# EAGLE design Adafruit NeoRGB Stemma Rev B (EAGLE 9.6.2)
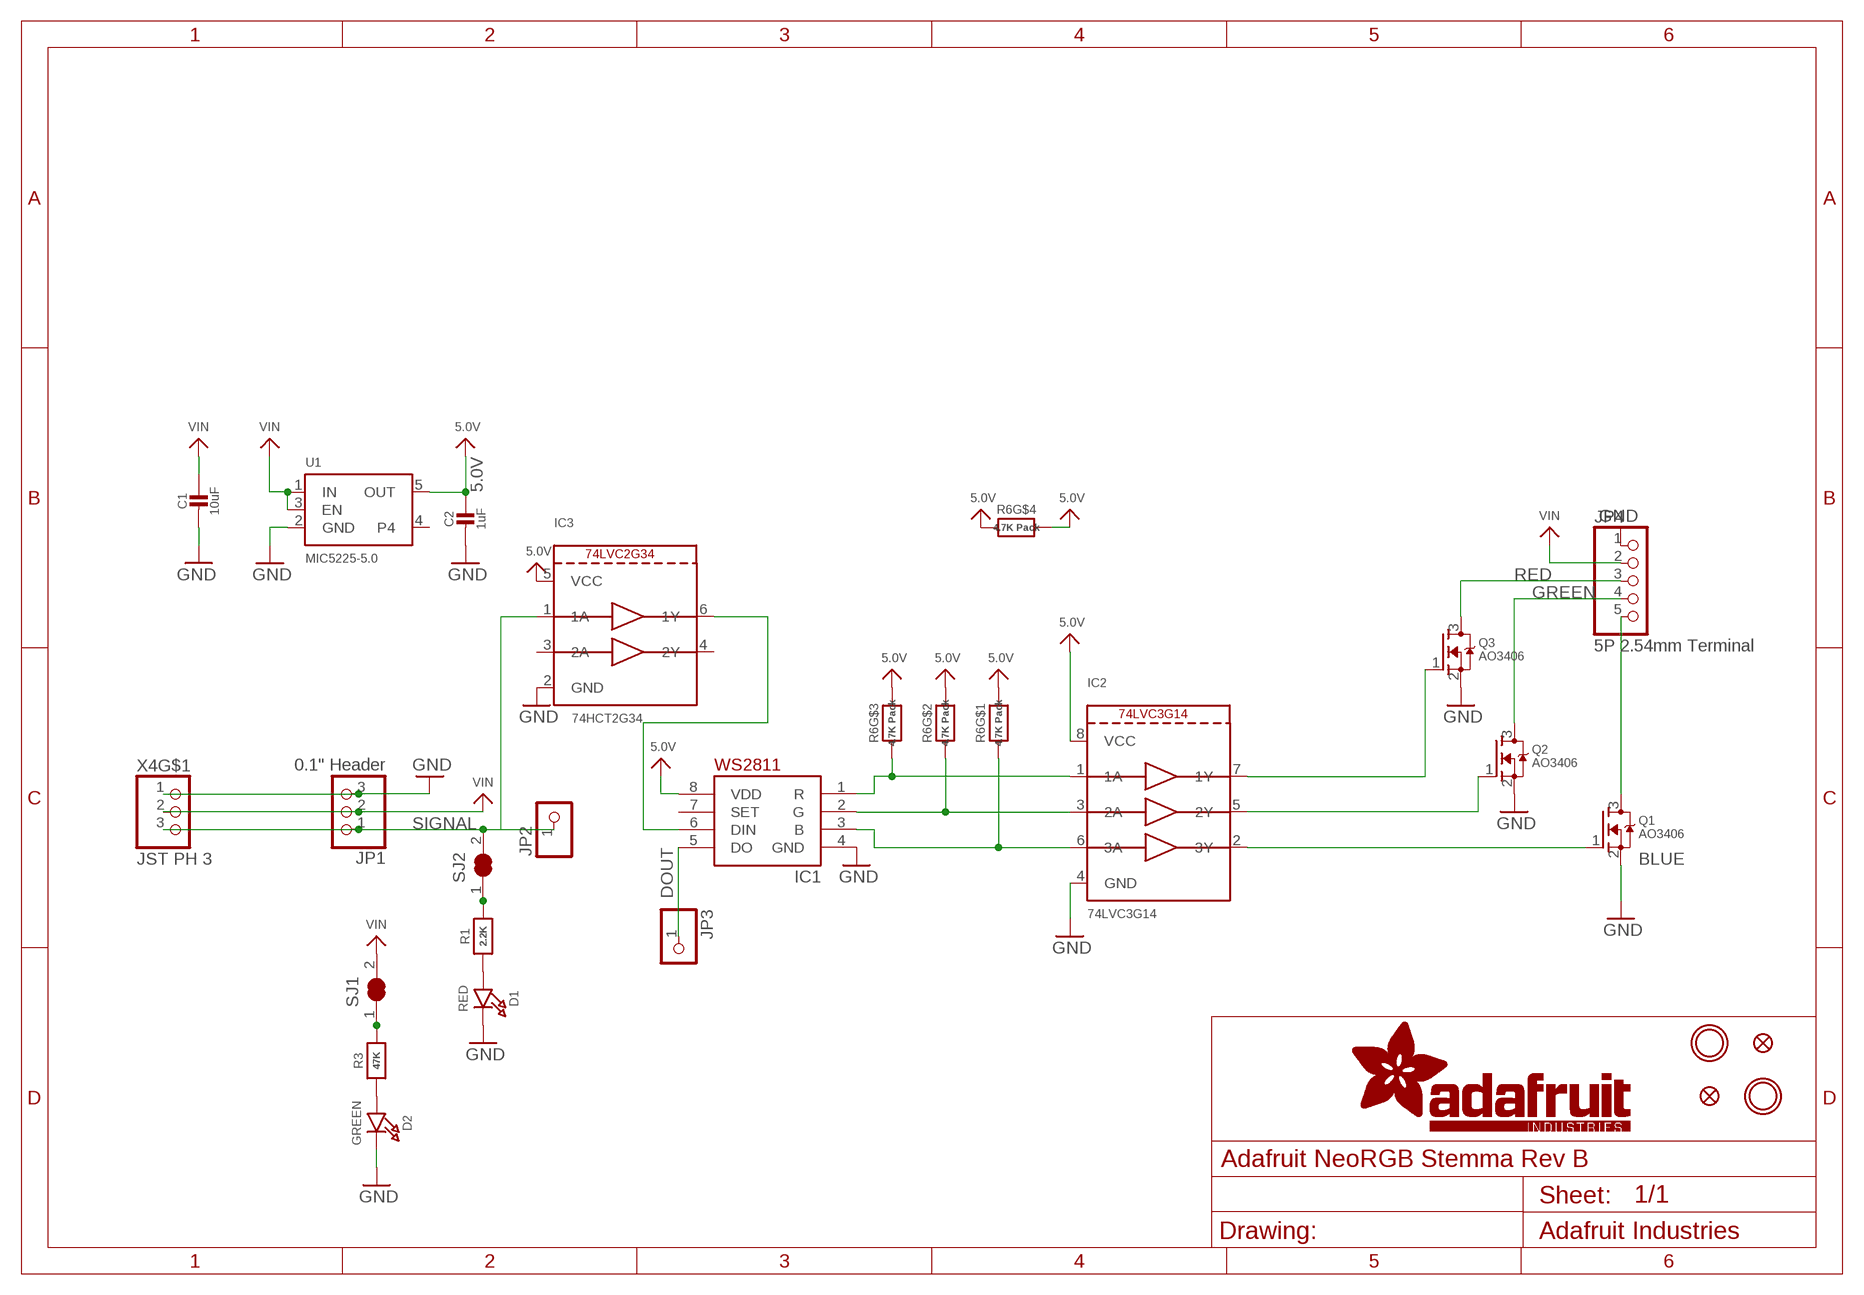
[diagram p0: schematic, sheet 1]

## Parts
C1  10uF  CAP_CERAMIC0805-NOOUTLINE  [0805-NO]
C2  1uF  CAP_CERAMIC0603_NO  [0603-NO]
D1  RED  LED0603_NOOUTLINE  [CHIPLED_0603_NOOUTLINE]
D2  GREEN  LED0603_NOOUTLINE  [CHIPLED_0603_NOOUTLINE]
FID2  FIDUCIAL_1MM  [FIDUCIAL_1MM]
FID3  FIDUCIAL_1MM  [FIDUCIAL_1MM]
IC1  WS2811F  [FSOP-8]
IC2  74LVC3G14  [VFSOP-8]
IC3  74HCT2G34  74LVC2G34  [SC70-6L]
JP1  0.1" Header  HEADER-1X3  [1X03_OVAL]
JP2  HEADER-1X1ROUND  [1X01_ROUND]
JP3  HEADER-1X1ROUND  [1X01_ROUND]
JP4  5P 2.54mm Terminal  HEADER-1X5_2.54MMTERM  [1X05_2.54MMTERMINAL]
Q1  AO3406  MOSFET-NWIDE  [SOT23-WIDE]
Q2  AO3406  MOSFET-NWIDE  [SOT23-WIDE]
Q3  AO3406  MOSFET-NWIDE  [SOT23-WIDE]
R1  2.2K  RESISTOR_0603_NOOUT  [0603-NO]
R3  47K  RESISTOR_0603_NOOUT  [0603-NO]
R6  4.7K Pack  RESISTOR_4PACK_0804  [RESPACK_4X0402]
SJ1  SOLDERJUMPER_CLOSED  [SOLDERJUMPER_CLOSEDWIRE]
SJ2  SOLDERJUMPER_CLOSED  [SOLDERJUMPER_CLOSEDWIRE]
U1  MIC5225-5.0  VREG_SOT23-5  [SOT23-5]
U$1  MOUNTINGHOLE2.5  [MOUNTINGHOLE_2.5_PLATED]
U$8  MOUNTINGHOLE2.5  [MOUNTINGHOLE_2.5_PLATED]
X4  JST PH 3  CON_JST_PH_3PIN  [JSTPH3]

## Nets
5.0V: C2.1 IC1.8(VDD) IC2.8(VCC) IC3.5(VCC) R6.4 R6.5 R6.6 R6.7 R6.8 U1.5(OUT)
BLUE: JP4.5 Q1.3(D)
DOUT: IC1.5(DO) JP3.1
GND: C1.2 C2.2 D1.C D2.C IC1.4(GND) IC2.4(GND) IC3.2(GND) JP1.3 JP4.1 Q1.2(S) Q2.2(S) Q3.2(S) U1.2(GND) X4.1
GREEN: JP4.4 Q2.3(D)
N$1: R3.2 SJ1.1
N$2: D1.A R1.1
N$3: R1.2 SJ2.1
N$4: IC2.2(3Y) Q1.1(G)
N$5: IC2.5(2Y) Q2.1(G)
N$6: IC2.7(1Y) Q3.1(G)
N$7: IC1.1(R) IC2.1(1A) R6.3
N$8: IC1.2(G) IC2.3(2A) R6.2
N$9: IC1.3(B) IC2.6(3A) R6.1
N$10: IC1.6(DIN) IC3.6(1Y)
N$26: D2.A R3.1
RED: JP4.3 Q3.3(D)
SIGNAL: IC3.1(1A) JP1.1 JP2.1 SJ2.2 X4.3
VIN: C1.1 JP1.2 JP4.2 SJ1.2 U1.1(IN) U1.3(EN) X4.2
Unconnected: IC1.7(SET) IC3.3(2A) IC3.4(2Y) U1.4 X4.NC1(MT) X4.NC2(MT)

## Library data of the parts
C1 C2 = microbuilder:CAP_CERAMIC: Ceramic Capacitors For new designs, use the packages preceded by an '_' character since they are more reliable: The following footprints should be used on most boards: _0402 - Standard footprint for regular board layouts _0603 - Standard footprint for regular board layouts _0805 - Standard footprint for regular board layouts _1206 - Standard footprint for regular board layouts For extremely tight-pitch boards where space is at a premium, the following 'micro-pitch' footprints can be used (smaller pads, no silkscreen outline, etc.): _0402MP - Micro-pitch footprint for very dense/compact boards _0603MP - Micro-pitch footprint for very dense/compact boards _0805MP - Micro-pitch footprint for very dense/compact boards _1206MP - Micro-pitch footprint for very dense/compact boards
D1 D2 = microbuilder:LED: LED 0603 - 0603 Surface Mount Package 2mA: Green LED - Low Power (3.9mcd, 2ma, 1.7Vf) - Digikey: 475-2709-2-ND Orange LED - Low Power (9.8mcd, 2ma, 1.8Vf) - Digikey: 475-1194-2-ND Red LED - Low Power (5mcd, 2ma, 1.8Vf) - Digikey: 475-1195-2-ND Yellow LED - Low Power (7mcd, 2ma, 1.8Vf) - Digikey: 475-1196-2-ND 5mA: Blue LED - Low Power (17mcd, 5ma, 2.9Vf) - Digikey: LNJ937W8CRACT-ND 0805 - 0805 Surface Mount Package 2mA: Red LED (8.8mcd, 2mA, 1.8Vf, Clear) - Low Power [Digikey: 475-2510-1-ND] Green LED (5mcd, 2mA, 1.8Vf, Clear) - Low Power [Digikey: 475-2730-1-ND] Yellow LED (11.3mcd, 2mA, 1.8Vf, Clear) - Low Power [Digikey: 475-2555-1-ND] 20mA: Red LED (104mcd, 20mA, Diffused) - LS R976 [Digikey: 475-1278-6-ND] Red LED (12mcd, 20mA, 2.0Vf, Clear) - APT2012EC [Digikey: 754-1128-1-ND] Green LED (15mcd, 20mA, 2.2Vf, Clear) - APT2012GC [Digikey: 754-1131-1-ND] Orange LED (160mcd, 20mA, 2.1Vf, Clear) - APT2012SECK [Digikey: 754-1130-1-ND] 1206 - 1206 Surface Mount Package Green LED (26mcd, 20mA, Diffused) - LG N971 [Digikey: 475-1407-6-ND] Red LED (15mcd, 20mA, Diffused) - LH N974 [Digikey: 475-1416-6-ND] Cree - Cree High-Power Surface Mount LEDs XPEBWT-L1-0000-00D50 - White 111lm 350mA 2.9Vf 6200K 110° XTEAWT-00-0000-00000LEE3 - White 114lm 350mA 2.85Vf 5000K 115° Everlight - Everlight 45-21 Series Surface Mount LEDs 45-21/QK2C-B2832AC2CB2/2T - Warm White 2000mcd 20mA 3.25Vf 3050K 120° 45-21/LK2C-B38452C4CB2/2T - Nuetral White 2000mcd 20mA 3.25Vf 4150K 120° 45-21/LK2C-B50634C6CB2/2T - Cold White 2200mcd 20mA 3.25Vf 5650K 120° PLCC2 Reverse Mount LS T77K-J1L2-1-0-2-R18-Z - Red 11.25mcd 2mA 1.8Vf 630nm 120° LO T77K-L1M2-24-Z - Orange 19.6mcd 2mA 1.8Vf 606nm 120° LY T77K-K2M1-26-Z - Yellow 15.7mcd 2mA 1.8Vf 587nm 120°; ROT: 270
FID2 FID3 = microbuilder:FIDUCIAL: Fiducial Alignment Points Various fiducial points for machine vision alignment.; BOM: EXCLUDE
IC1 = microbuilder:WS2811
IC2 = microbuilder:74LVC3G14
IC3 = microbuilder:74LVC2G34
JP1 = microbuilder:HEADER-1X3: PIN HEADER
JP2 JP3 = microbuilder:HEADER-1X1: PIN HEADER
JP4 = microbuilder:HEADER-1X5: PIN HEADER
Q1-Q3 = microbuilder:MOSFET-N: N-Channel Mosfet LEGEND VDS: Voltage Drain-Source ID: Drain Current RDS(ON): Drain-Source On-State Resistance VGS(TH): Gate-Source Threshold Voltage CISS: Drain-Source Input Capacitance SOT-23 Name VDS ID RDS(ON) VGS(TH) CISS Order Number 2N7002E 60V 260mA 2.5 Ohm 2.5V @ 250uA 26.7pF @ 25V 2N7002ET1GOSTR-ND BSH103 30V 850mA 400 mOhm 400mV @ 1mA 83pF @ 24V BSH103,235-ND BSS138 60V 320mA 1.6 Ohm 1.5V @ 250uA 50pF @ 10V Mouser: 771-BSS138PW115 DMN2075U-7 20V 4.2A 38 mOhm 1V @ 250 uA 594.3pF @ 10V DMN2075U-7DICT-ND * BSS138 good choice for I2C level-shifting POWERPAK 1212-8 Name VDS ID RDS(ON) VGS(TH) CISS Order Number Si7308DN 60V 6A 58 mOhm 3V @ 250uA 665pF @ 15V SI7308DN-T1-E3CT-ND
R1 R3 = microbuilder:RESISTOR: Resistors For new designs, use the packages preceded by an '_' character since they are more reliable: The following footprints should be used on most boards: _0402 - Standard footprint for regular board layouts _0603 - Standard footprint for regular board layouts _0805 - Standard footprint for regular board layouts _1206 - Standard footprint for regular board layouts For extremely tight-pitch boards where space is at a premium, the following 'micro-pitch' footprints can be used (smaller pads, no silkscreen outline, etc.): _0402MP - Micro-pitch footprint for very dense/compact boards _0603MP - Micro-pitch footprint for very dense/compact boards _0805MP - Micro-pitch footprint for very dense/compact boards _1206MP - Micro-pitch footprint for very dense/compact boards
R6 = microbuilder:RESISTOR_4PACK: Resistor Packs (4 resistors) 4 x 0603 10K 1/16W - Digikey: YC164J-10KCT-ND
SJ1 SJ2 = microbuilder:SOLDERJUMPER_CLOSED: Solder Jumper - Closed These solder jumpers are closed by default CLOSEDWIRE - 10 mil trace between pads that can be cut and resoldered later CLOSEDPERM - 63 mil trace between pads for a permanent connection (used to 'bridge' two signals, a shameless hack for Eagle). Can double as a test point as well (no cream layer)
U1 = adafruit_power:VREG_SOT23-5: SOT23-5 Fixed Voltage Regulators Part Current Out V Out V In V Dropout θJA (°C/W) TJ (°C) Digikey Part No. ADP121 150mA 3.3V 3.4-5.5V 0.09V @ 150mA -- -- ADP121-AUJZ33R7CT-ND ADP121 150mA 3.0V 3.1-5.5V 0.09V @ 150mA -- -- ADP121-AUJZ30R7CT-ND ADP122 300mA 3.3V 3.4-5.5V 0.085V @ 300mA -- -- ADP122AUJZ-3.3-R7CT-ND ADP1712 300mA 3.3V 3.5-5.5V 0.17V @ 300mA -- -- ADP1712AUJZ-3.3-R7TR-ND AP7311 (Low Cost) 150mA 3.3V 3.5-6V 0.15V @ 150mA -- -- AP7311-33WG-7DICT-ND LD39015M18R 150mA 1.8V 1.9V-5.5V 0.08V @ 100mA -- -- 497-6977-1-ND LP2985A-33DBVR 150mA 3.3V 3.3-16V 0.28V @ 150mA 206 150 296-18479-1-ND MCP1824T-3302E/OT 300mA 3.3V 3.5V-6V 0.2V @ 300mA -- -- MCP1824T-3302E/OTCT-ND MIC5205-2.5YM5 TR 150mA 2.5V 2.7-16V 0.165V @ 150mA -- -- 576-1257-2-ND MIC5205-3.0YM5 TR 150mA 3.0V 3.2V-16V 0.165V @ 150mA -- -- 576-1258-2-ND MIC5205-3.3YM5 TR 150mA 3.3V 3.5V-16V 0.165V @ 150mA -- -- 576-1259-2-ND TPS780330220 150mA 3.3V+2.2V 3.6-5.5V 250mV Max -- -- 296-23332-1-ND TDA3663/N1,135 100mA 3.3V 3.5-45V 0.18V @ 50mA -- -- 568-5343-1-ND Max operating temp can be calculated using θJA, TJ (max junction temperature), and power in watts. Set the "Maximum Ambient Temperature" until it reaches TJ ("Max Junction Temperature"), which is the absolute limit for safe use of the regulator: Heat Sink Temperature Calculator <http://www.daycounter.com/Calculators/Heat-Sink-Temperature-Calculator.phtml> For example, With 12V source into a 3.3V LP2985 and a 30mA load, we are dissipating (12V-3.3V) * 0.03A = 0.261W. With a θJA of 206 °C/W, a TJ of 150°C, and 261mW we can safely use the chip without a heat sink up to 75°C (=147.1°C Junction Temperature).; JLC_ROTATION: 0
U$1 U$8 = adafruit_electromech:MOUNTINGHOLE: Mounting Hole For #2 screws (0.086"/2.18mm width, 0.094"/2.4mm hole) use 2.5mm; BOM: EXCLUDE
X4 = adafruit_electromech:CON_JST_PH_3PIN

## Net classes
1 HV: width 0.406 mm, drill 0.381 mm, clearance 0.762 mm

## Board
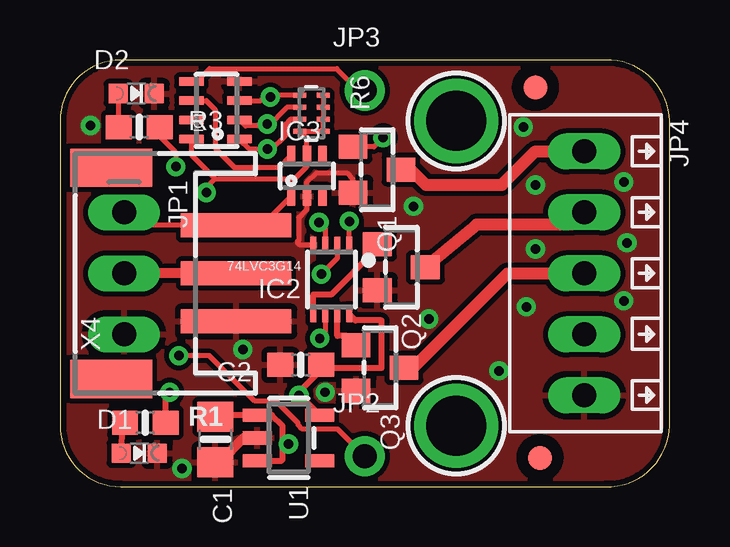
[diagram p1: board, top side]
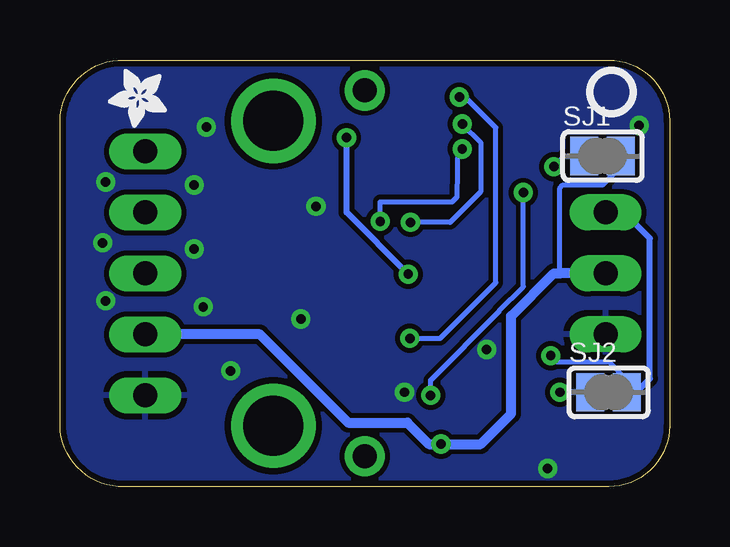
[diagram p2: board, bottom side, seen from below]

Size 25.4 x 17.78 mm. Coordinates in mm from the lower left corner, seen from the top.
Outline: 0,15.24 0,2.54 arc90 2.54,0 22.73,0 arc90 25.4,2.54 25.4,15.24 arc90 22.73,17.78 2.54,17.78 arc90 0,15.24
Copper layers (1*16): Top 0.035mm / dielectric 1.5mm / Bottom 0.035mm
Design rules "adafruit": minimum track width 8mil, minimum drill 15.5mil, track to track 8mil, track to pad 8mil, pad to pad 8mil, via to via 8mil, smd to smd 8mil, copper to edge 10mil, drill to drill 8mil, minimum pad ring 10mil, minimum via ring 8mil, stop-mask expansion 2mil, vias tented up to drill 20mil, thermal gap 10mil

### Footprints (pad centres in the part's own frame; a part is rotated, then mirrored left to right if it is on the bottom)
0805-NO = smd 1.24 x 1.5: 1 -0.95,0; 2 0.95,0
0603-NO = smd 1.075 x 1: 1 -0.85,0; 2 0.85,0
CHIPLED_0603_NOOUTLINE = smd 0.8 x 0.8: A 0,-0.75; C 0,0.75
FIDUCIAL_1MM = smd 1 x 1: 1 0,0
FSOP-8 = smd 0.35 x 1.02: 1 -1.2,-1; 2 -0.4,-1; 3 0.4,-1; 4 1.2,-1; 5 1.2,1; 6 0.4,1; 7 -0.4,1; 8 -1.2,1
VFSOP-8 = smd 0.25 x 0.65: 1 -0.75,-1.45; 2 -0.25,-1.45; 3 0.25,-1.45; 4 0.75,-1.45; 5 0.75,1.45; 6 0.25,1.45; 7 -0.25,1.45; 8 -0.75,1.45
SC70-6L = smd 0.35 x 0.8: 1 -0.65,-0.85; 2 0,-0.85; 3 0.65,-0.85; 4 0.65,0.85; 5 0,0.85; 6 -0.65,0.85
1X03_OVAL = drill 1 long: 1 -2.54,0; 2 0,0; 3 2.54,0
1X01_ROUND = drill 1 pad 1.676: 1 0,0
1X05_2.54MMTERMINAL = drill 1 long: 1 5.08,0; 2 2.54,0; 3 0,0; 4 -2.54,0; 5 -5.08,0
SOT23-WIDE = smd 1 x 1.2: 1 -0.95,-1; 2 0.95,-1; 3 0,1
RESPACK_4X0402 = smd 0.203 x 0.533: 1 -0.75,-0.486; 2 -0.25,-0.486; 3 0.25,-0.486; 4 0.75,-0.486; 5 0.75,0.486; 6 0.25,0.486; 7 -0.25,0.486; 8 -0.75,0.486
SOLDERJUMPER_CLOSEDWIRE = smd 1.168 x 1.6: 1 -0.762,0; 2 0.762,0 | smd 0.635 x 0.203: WIRE 0,0
SOT23-5 = smd 0.55 x 1.2: 1 -0.95,-1.3; 2 0,-1.3; 3 0.95,-1.3; 4 0.95,1.3; 5 -0.95,1.3
MOUNTINGHOLE_2.5_PLATED = drill 2.5 pad 3.2: P$1 0,0
JSTPH3 = smd 1 x 4.6: 1 -2,-2.7; 2 0,-2.7; 3 2,-2.7 | smd 1.6 x 3.4: NC1 -4.4,2.5; NC2 4.4,2.5

### Placement (x,y rotation side)
C1  6.48,1.97 270 top
C2  10.03,5.08 180 top
D1  3.3,1.4 270 top
D2  3.17,16.38 270 top
E$1  [ADAFRUIT_2.5MM]  20.95,17.4 180 bottom
FID2  19.81,16.64 0 top
FID3  20,1.21 0 top
IC1  6.48,15.68 90 top
IC2  11.3,8.64 180 top
IC3  10.29,12.95 0 top
JP1  2.67,8.89 270 top
JP2  12.7,1.27 0 top
JP3  12.7,16.51 0 top
JP4  21.84,8.89 270 top
PLABEL0  [PLABEL0]  1.78,14.48 90 top
PLABEL1  [PLABEL1]  1.78,1.14 90 top
PLABEL2  [PLABEL2]  21.59,15.88 0 top
PLABEL3  [PLABEL3]  15.49,11.05 0 top
PLABEL4  [PLABEL4]  16,8.51 0 top
PLABEL5  [PLABEL5]  16,5.59 0 top
PLABEL6  [PLABEL6]  21.34,1.02 0 top
PLABEL7  [PLABEL7]  13.46,9.27 90 bottom
PLABEL8  [PLABEL8]  24.32,13.46 90 bottom
PLABEL9  [PLABEL9]  24.32,10.92 90 bottom
PLABEL10  [PLABEL10]  24.32,8.26 90 bottom
PLABEL11  [PLABEL11]  24.32,4.83 90 bottom
PLABEL12  [PLABEL12]  11.68,16.57 0 bottom
PLABEL13  [PLABEL13]  6.73,9.08 0 bottom
PLABEL14  [PLABEL14]  7.75,6.41 0 bottom
PLABEL15  [PLABEL15]  7.24,11.49 0 bottom
PLABEL16  [PLABEL16]  24,2.1 0 bottom
PLABEL17  [PLABEL17]  11.68,1.21 0 bottom
PLABEL18  [PLABEL18]  3.94,2.1 0 bottom
Q1  13.21,13.21 270 top
Q2  14.22,9.14 270 top
Q3  13.34,4.95 270 top
R1  3.56,2.67 0 top
R3  3.3,14.99 0 top
R6  10.48,15.56 270 top
SJ1  2.79,13.78 0 bottom
SJ2  2.54,3.94 0 bottom
U1  9.53,2.03 270 top
U$1  16.51,2.54 0 top
U$5  [PCBFEAT-REV-040]  2.41,16.45 0 bottom
U$8  16.51,15.24 0 top
X4  4.64,8.89 90 top

### Tracks (layer width: path | path; a pad name or v marks a point on that pad's centre or on a via)
5.0V  (via drill 0.39)
  Top 0.203: IC1.8 5.48,13.83 6.48,12.83 | 6.48,12.83 9.78,12.83 10.29,13.34 IC3.5 10.29,14.51 R6.4 R6.5 R6.6 R6.7 R6.8 | v6.1,12.26 6.1,12.45 6.48,12.83
  Top 0.254: IC2.8 12.31,6.93 13.39,6.93 13.39,4.95 11.02,4.95 C2.1 10.88,4.87 9.96,3.94 v9.96,3.81 10,3.81 U1.5
  Bottom 0.203: v9.96,3.81 9.96,4.45 7.11,7.29 7.11,7.32 6.1,8.34 v6.1,12.26
BLUE
  Top 0.508: Q1.3 14.61,13.21 15.24,12.57 18.41,12.57 19.81,13.97 JP4.5
DOUT
  Top 0.203: IC1.5 5.68,16.88 6.22,17.42 11.53,17.42 12.45,16.51 JP3.1
GND  (via drill 0.39)
  Top 0.203: Q1.2 12.21,12.81 11.94,13.08 10.67,13.08 10.29,12.7 IC3.2 10.29,11.56 9.94,11.21 9.94,10.26 9.91,10.23 9.91,10.16 9.98,10.09 IC2.4
  Top 0.406: U1.2 7.66,2.03 6.65,1.02 C1.2
  other vias: 19.81,12.57 19.81,9.91 15.37,6.99 14.73,11.68 7.62,5.71 5.08,0.76 23.5,12.7 19.3,14.99 23.62,10.16 23.5,7.75 19.43,7.49 18.29,4.83 11.05,3.94 1.27,15.05
  pour Top: 0,17.78 25.4,17.78 25.4,0 0,0
  pour Bottom: 0,17.78 25.4,17.78 25.4,0 0,0
GREEN
  Top 0.508: Q2.3 17.36,10.92 21.34,10.92 JP4.4
N$1  (via drill 0.39)
  Top 0.203: R3.2 4.15,14.61 4.83,13.93 v4.83,13.34
  Bottom 0.203: v4.83,13.34 4.38,13.78 SJ1.1
N$2
  Top 0.254: R1.1 2.57,2.54 D1.A
N$3  (via drill 0.39)
  Top 0.254: R1.2 4.41,3.68 4.62,3.89 v4.57,3.94
  Bottom 0.254: SJ2.1 v4.57,3.94
N$4  (via drill 0.39)
  Top 0.203: IC2.2 11.55,9.52 v10.89,8.86 | Q1.1 13.08,14.16 v13.46,14.54
  Bottom 0.254: v10.89,8.86 13.46,11.43 v13.46,14.54
N$5
  Top 0.254: IC2.5 10.55,8 11.29,8 13.22,9.93 Q2.1
N$6
  Top 0.254: Q3.1 11.95,6.28 11.55,6.28 IC2.7
N$7  (via drill 0.39)
  Top 0.203: R6.3 9.59,15.31 9.38,15.09 9.38,14.6 8.79,14.01 v8.64,14.07 7.89,14.07 IC1.1 | IC2.1 v12.05,11.05 v12.06,11.06
  Bottom 0.203: v12.06,11.06 12.06,11.87 9.06,11.87 8.87,12.06 8.83,14.26 v8.64,14.07
N$8  (via drill 0.39)
  Top 0.203: IC1.2 7.73,15.03 8.64,15.03 v8.64,15.11 8.64,14.99 9.46,15.81 R6.2 | v10.79,11.01 11.05,10.76 IC2.3
  Bottom 0.203: v8.64,15.11 7.87,14.35 7.87,12.28 9.14,11.01 v10.79,11.01
N$9  (via drill 0.39)
  Top 0.203: IC1.3 8.37,16.08 8.66,16.37 8.76,16.37 v8.76,16.24 8.83,16.31 R6.1 | IC2.6 11.05,6.41 v10.82,6.18
  Bottom 0.203: v8.76,16.24 8.51,16.24 7.24,14.97 7.24,8.51 9.56,6.18 v10.82,6.18
N$10
  Top 0.203: IC1.6 6.1,16.08 6.48,15.7 6.48,14.1 7.28,13.3 9.13,13.3 IC3.6
N$26
  Top 0.203: D2.A 2.42,15.01 R3.1
RED
  Top 0.508: Q3.3 14.72,4.95 18.65,8.89 JP4.3
SIGNAL  (via drill 0.39)
  Top 0.203: JP2.1 11.57,2.4 10.1,2.4 9.92,2.58 9.92,2.65 9.01,3.56 8.12,3.56 6.22,5.46 v4.95,5.46 | IC3.1 8.42,10.89 X4.3 3.21,10.89 JP1.1
  Bottom 0.203: v4.95,5.46 4.7,5.21 2.54,5.21 1.78,4.45 SJ2.2
  Bottom 0.254: SJ2.2 1.4,3.94 0.83,4.51 0.83,10.35 1.91,11.43 JP1.1
VIN  (via drill 0.39)
  Top 0.254: C1.1 6.54,2.98 U1.1 8.83,2.98 9.27,2.54 9.27,1.78 | U1.3 9.21,1.08 9.27,1.14 9.27,1.78 | 9.27,1.78 v9.53,1.78
  Top 0.406: X4.2 JP1.2
  Bottom 0.203: 4.57,8.89 4.57,12.45 4.45,12.57 2.79,12.57 2.03,13.34 SJ1.2
  Bottom 0.406: JP4.2 17.07,6.35 13.39,2.67 10.92,2.67 10.03,1.78 v9.53,1.78 7.87,1.78 6.6,3.05 6.6,7.11 4.83,8.89 4.57,8.89 JP1.2

### Text on the board
Pinguin_tBackup: BLU | ON | GRN | RED | VIN | SIG | GND
Pinguin_bBackup: Neo Out | B | Neo | G | Vin | NeoPixel / to RGB / Com Anode / Vin:3-16V / 3A/channel | R | GND | Vin | LED | GND | Neo In